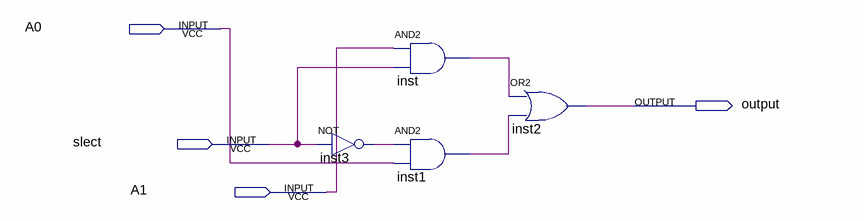
[diagram p0: schematic sheet]
// Quartus schematic mux.bdf as structural Verilog: 4 symbols, 4 pins
module mux (
  input  A0,
  input  slect,
  input  A1,
  output \output 
);

  wire inst1_out, inst3_out, inst_out;

  not inst3 (inst3_out, slect);
  and inst (inst_out, A1, slect);
  and inst1 (inst1_out, inst3_out, A0);
  or inst2 (\output , inst_out, inst1_out);
endmodule
